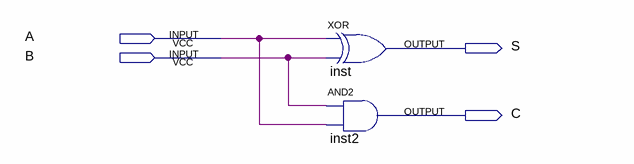
[diagram p0: schematic sheet]
// Quartus schematic ham_HA.bdf as structural Verilog: 2 symbols, 4 pins
module ham_HA (
  input  A,
  input  B,
  output S,
  output C
);

  xor inst (S, A, B);
  and inst2 (C, B, A);
endmodule
